# Altium schematic sheet [02]-STLinkV2_1.SchDoc (part 3 of 3)
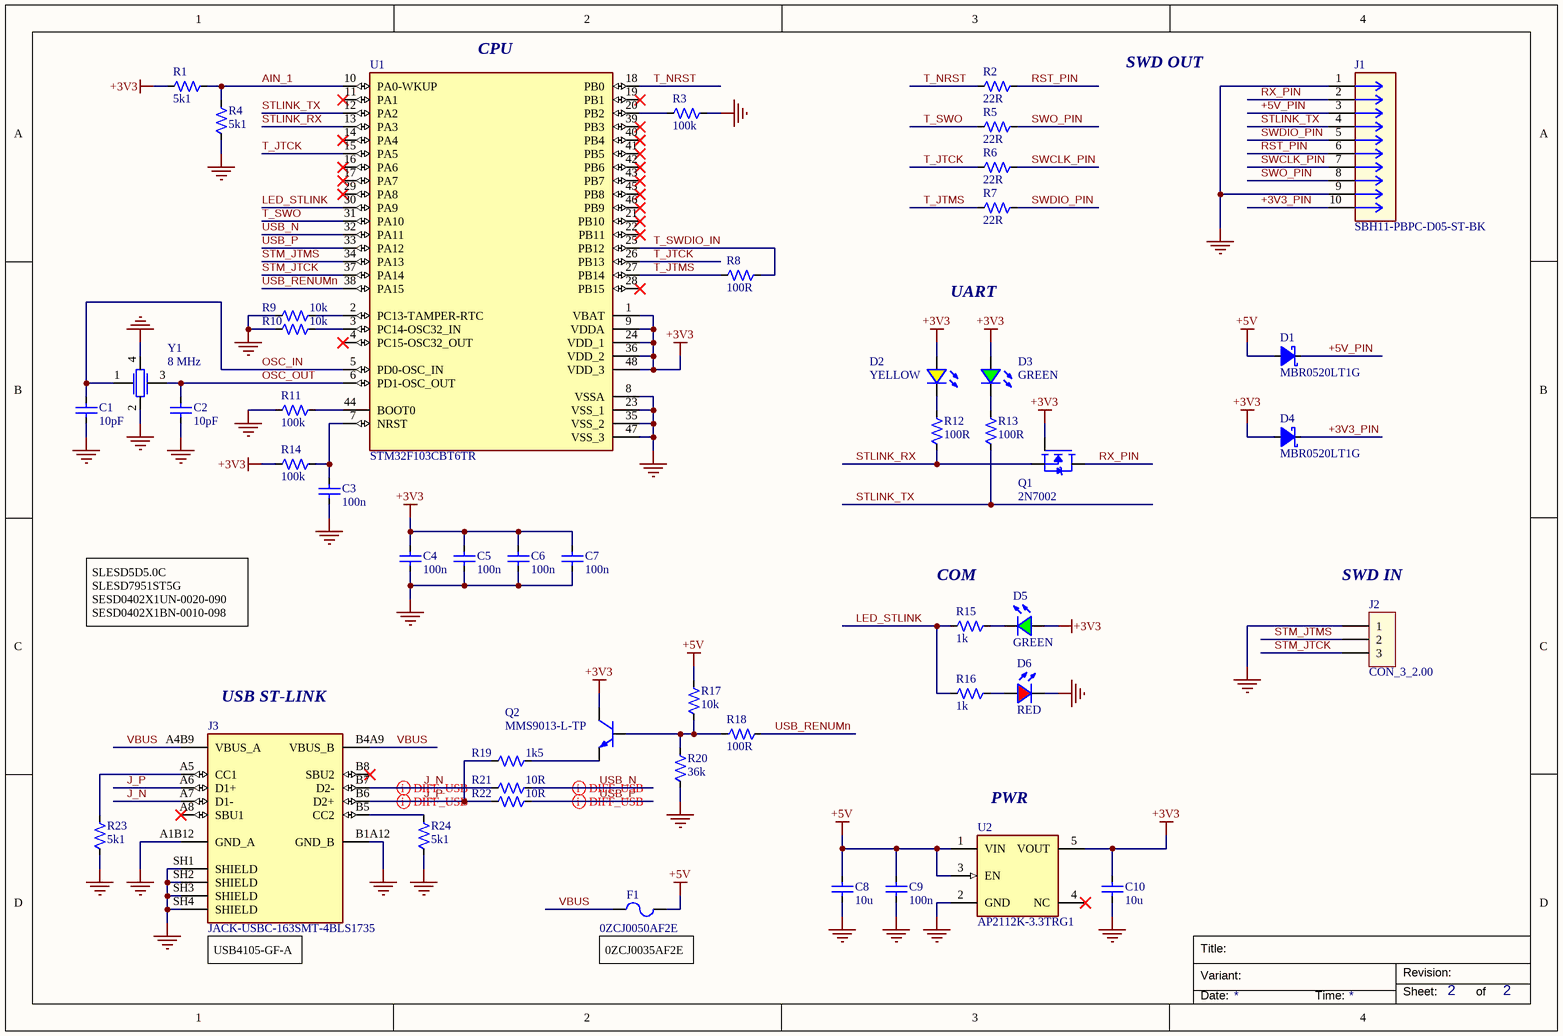
[diagram p2: [02]-STLinkV2_1.SchDoc]

## Library data of the parts (continued)
R19 = RES_AC0402FR-7W1K5L: Fixed Resistor, Metal Glaze/thick Film, 0.125W, 1500ohm, 75V, 1% +/-Tol, 100ppm/Cel, Surface Mount, 0402; Manufacturer 1: Yageo Group; Power Dissipation: 125mW; Resistance: 1.5kΩ; Temperature Coefficient: 100ppm/°C; Voltage Rating: 50V; Supplier 1: DigiKey; Manufacturer Part Number 1: AC0402FR-7W1K5L; Stock 1: 7370; Pricing 1: 1=0,1, 10=0,006, 25=0,0056, 50=0,0052, 100=0,005 (USD); RoHS: Compliant; Case/Package: 0402; China RoHS: Non-Compliant; Composition: Thick Film; Country of Origin: Mainland China, Taiwan; Export Control Classification Number (ECCN) Code: EAR99; Height: 320µm; Harmonized Tariff Schedule (HTS) Code: 8533.21.00.30; Introduction Date: 2017-06-20; Lifecycle Status: Production; Max Operating Temperature: 155°C; Min Operating Temperature: -55°C; Mount: Surface Mount; Number of Terminals: 2; Packaging: Tape & Reel; Power Rating: 125mW; REACH SVHC: Yes; Tolerance: 1%; Width: 500µm; Working Voltage: 75V; ComponentLink1URL: https://datasheet.octopart.com:443/AC0402FR-7W1K5L-Yageo-datasheet-182189377.pdf?src-supplier=IHS; ComponentLink1Description: https://datasheet.octopart.com:443/AC0402FR-7W1K5L-Yageo-datasheet-182189377.pdf?src-supplier=IHS; ComponentLink2URL: https://datasheet.octopart.com:443/AC0402FR-7W1K5L-Yageo-datasheet-83209224.pdf?src-supplier=Upverter; ComponentLink2Description: https://datasheet.octopart.com:443/AC0402FR-7W1K5L-Yageo-datasheet-83209224.pdf?src-supplier=Upverter; ComponentLink3URL: https://datasheet.octopart.com:443/AC0402FR-7W1K5L-Yageo-datasheet-178509465.pdf?src-supplier=Farnell; ComponentLink3Description: https://datasheet.octopart.com:443/AC0402FR-7W1K5L-Yageo-datasheet-178509465.pdf?src-supplier=Farnell; ComponentLink4URL: https://datasheet.octopart.com:443/AC0402FR-7W1K5L-Yageo-datasheet-166720450.pdf?src-supplier=Future+Electronics; ComponentLink4Description: https://datasheet.octopart.com:443/AC0402FR-7W1K5L-Yageo-datasheet-166720450.pdf?src-supplier=Future+Electronics; ComponentLink5URL: https://datasheet.octopart.com:443/AC0402FR-7W1K5L-Yageo-datasheet-151884373.pdf?src-supplier=Future+Electronics; ComponentLink5Description: https://datasheet.octopart.com:443/AC0402FR-7W1K5L-Yageo-datasheet-151884373.pdf?src-supplier=Future+Electronics; ComponentLink6URL: https://datasheet.octopart.com/AC0402FR-7W1K5L-Yageo-datasheet-12512238.pdf; ComponentLink6Description: https://datasheet.octopart.com/AC0402FR-7W1K5L-Yageo-datasheet-12512238.pdf; ComponentLink7URL: http://sigma.octopart.com:80/conflict_mineral_statement/Yageo-company-3.pdf?src-supplier=Compliance+Statements; ComponentLink7Description: http://sigma.octopart.com:80/conflict_mineral_statement/Yageo-company-3.pdf?src-supplier=Compliance+Statements; ComponentLink8URL: http://sigma.octopart.com:80/rohs_statement/Yageo-company-2.pdf?src-supplier=Compliance+Statements; ComponentLink8Description: http://sigma.octopart.com:80/rohs_statement/Yageo-company-2.pdf?src-supplier=Compliance+Statements; Supplier Part Number 1: 13-AC0402FR-7W1K5LCT-ND
R20 = RES_AC0402FR-7W36KL: Chip Resistor Automotive Grade Thick Film 0402 36kOhm 1% Paper T/R; Manufacturer 1: Yageo Group; Power Dissipation: 125mW; Resistance: 36kΩ; Temperature Coefficient: 100ppm/°C; Voltage Rating: 50V; Working Voltage: 75V; Supplier 1: DigiKey; Manufacturer Part Number 1: AC0402FR-7W36KL; Stock 1: 7740; Pricing 1: 1=0,1, 10=0,008, 25=0,0068, 50=0,0052, 100=0,005 (USD); RoHS: Compliant; Case/Package: 0402; China RoHS: Non-Compliant; Composition: Thick Film; Height: 320µm; Lifecycle Status: Production; Max Operating Temperature: 155°C; Min Operating Temperature: -55°C; Mount: Surface Mount; Number of Terminals: 2; Packaging: Tape & Reel; Power Rating: 125mW; REACH SVHC: Yes; Tolerance: 1%; Width: 500µm; ComponentLink1URL: https://datasheet.octopart.com:443/AC0402FR-7W36KL-Yageo-datasheet-182189377.pdf?src-supplier=IHS; ComponentLink1Description: https://datasheet.octopart.com:443/AC0402FR-7W36KL-Yageo-datasheet-182189377.pdf?src-supplier=IHS; ComponentLink2URL: https://datasheet.octopart.com:443/AC0402FR-7W36KL-Yageo-datasheet-83209224.pdf?src-supplier=Upverter; ComponentLink2Description: https://datasheet.octopart.com:443/AC0402FR-7W36KL-Yageo-datasheet-83209224.pdf?src-supplier=Upverter; ComponentLink3URL: https://datasheet.octopart.com:443/AC0402FR-7W36KL-Yageo-datasheet-178509465.pdf?src-supplier=Farnell; ComponentLink3Description: https://datasheet.octopart.com:443/AC0402FR-7W36KL-Yageo-datasheet-178509465.pdf?src-supplier=Farnell; ComponentLink4URL: https://datasheet.octopart.com:443/AC0402FR-7W36KL-Yageo-datasheet-166720450.pdf?src-supplier=Future+Electronics; ComponentLink4Description: https://datasheet.octopart.com:443/AC0402FR-7W36KL-Yageo-datasheet-166720450.pdf?src-supplier=Future+Electronics; ComponentLink5URL: https://datasheet.octopart.com:443/AC0402FR-7W36KL-Yageo-datasheet-151884373.pdf?src-supplier=Future+Electronics; ComponentLink5Description: https://datasheet.octopart.com:443/AC0402FR-7W36KL-Yageo-datasheet-151884373.pdf?src-supplier=Future+Electronics; ComponentLink6URL: https://datasheet.octopart.com/AC0402FR-7W36KL-Yageo-datasheet-12512238.pdf; ComponentLink6Description: https://datasheet.octopart.com/AC0402FR-7W36KL-Yageo-datasheet-12512238.pdf; ComponentLink7URL: http://sigma.octopart.com:80/conflict_mineral_statement/Yageo-company-3.pdf?src-supplier=Compliance+Statements; ComponentLink7Description: http://sigma.octopart.com:80/conflict_mineral_statement/Yageo-company-3.pdf?src-supplier=Compliance+Statements; ComponentLink8URL: http://sigma.octopart.com:80/rohs_statement/Yageo-company-2.pdf?src-supplier=Compliance+Statements; ComponentLink8Description: http://sigma.octopart.com:80/rohs_statement/Yageo-company-2.pdf?src-supplier=Compliance+Statements; Supplier Part Number 1: 13-AC0402FR-7W36KLCT-ND
R21 R22 = RES_AC0402FR-7W10RL: Res Thick Film 0402 10 Ohm 1% 0.125W(1/8W) ±100ppm/C Pad SMD T/R Automotive AEC-Q200; Manufacturer 1: Yageo Group; Power Dissipation: 125mW; Resistance: 10Ω; Temperature Coefficient: 100ppm/°C; Voltage Rating: 50V; Working Voltage: 75V; Supplier 1: DigiKey; Manufacturer Part Number 1: AC0402FR-7W10RL; Stock 1: 159700; Pricing 1: 1=0,1, 10=0,009, 25=0,008, 50=0,0072, 100=0,0068 (USD); RoHS: Compliant; Case/Package: 0402; China RoHS: Non-Compliant; Composition: Thick Film; Country of Origin: Mainland China, Taiwan; Export Control Classification Number (ECCN) Code: EAR99; Height: 320µm; Harmonized Tariff Schedule (HTS) Code: 8533.21.00.30; Introduction Date: 2017-06-20; Lifecycle Status: Production; Max Operating Temperature: 155°C; Min Operating Temperature: -55°C; Mount: Surface Mount; Number of Terminals: 2; Packaging: Tape & Reel; Power Rating: 125mW; REACH SVHC: Yes; Tolerance: 1%; Width: 500µm; ComponentLink1URL: https://datasheet.octopart.com:443/AC0402FR-7W10RL-Yageo-datasheet-182189377.pdf?src-supplier=IHS; ComponentLink1Description: https://datasheet.octopart.com:443/AC0402FR-7W10RL-Yageo-datasheet-182189377.pdf?src-supplier=IHS; ComponentLink2URL: https://datasheet.octopart.com:443/AC0402FR-7W10RL-Yageo-datasheet-83209224.pdf?src-supplier=Upverter; ComponentLink2Description: https://datasheet.octopart.com:443/AC0402FR-7W10RL-Yageo-datasheet-83209224.pdf?src-supplier=Upverter; ComponentLink3URL: https://datasheet.octopart.com:443/AC0402FR-7W10RL-Yageo-datasheet-178509465.pdf?src-supplier=Farnell; ComponentLink3Description: https://datasheet.octopart.com:443/AC0402FR-7W10RL-Yageo-datasheet-178509465.pdf?src-supplier=Farnell; ComponentLink4URL: https://datasheet.octopart.com:443/AC0402FR-7W10RL-Yageo-Group-datasheet-164768995.pdf?src-supplier=ODG+(Origin+Data+Global); ComponentLink4Description: https://datasheet.octopart.com:443/AC0402FR-7W10RL-Yageo-Group-datasheet-164768995.pdf?src-supplier=ODG+(Origin+Data+Global); ComponentLink5URL: https://datasheet.octopart.com/AC0402FR-7W10RL-Yageo-datasheet-12512238.pdf; ComponentLink5Description: https://datasheet.octopart.com/AC0402FR-7W10RL-Yageo-datasheet-12512238.pdf; ComponentLink6URL: http://sigma.octopart.com:80/conflict_mineral_statement/Yageo-company-3.pdf?src-supplier=Compliance+Statements; ComponentLink6Description: http://sigma.octopart.com:80/conflict_mineral_statement/Yageo-company-3.pdf?src-supplier=Compliance+Statements; ComponentLink7URL: http://sigma.octopart.com:80/rohs_statement/Yageo-company-2.pdf?src-supplier=Compliance+Statements; ComponentLink7Description: http://sigma.octopart.com:80/rohs_statement/Yageo-company-2.pdf?src-supplier=Compliance+Statements; Supplier Part Number 1: 13-AC0402FR-7W10RLCT-ND
U1 = STM32F103CBT6TR: MCU 32-bit STM32F1 ARM Cortex M3 RISC 128KB Flash 2.5V/3.3V 48-Pin LQFP T/R; Manufacturer 1: STMicroelectronics; ADC Channels (Resolution): 10-Ch 12-Bit; Data Bus Width: 32b; EEPROM Memory Size: 0B; Frequency: 72MHz; Interface: CAN, IrDA, LIN, USB; Max Frequency: 1.25MHz; Max Junction Temperature (Tj): 105°C; Max Power Dissipation: 363mW; Max Supply Current: 50mA; Max Supply Voltage: 3.6V; Min Supply Voltage: 2V; Nominal Supply Current: 1.7µA; Number of A/D Converters: 2; Number of ADC Channels: 10; Number of I/Os: 37; Number of PWM Channels: 4; Number of UART Channels: 3; Number of USB Channels: 1; Operating Supply Voltage: 3.3V; Oscillator Type: Internal; Peripherals: POR; RAM Size: 20kB; Watchdog Timer: Yes; Supplier 1: DigiKey; Manufacturer Part Number 1: STM32F103CBT6TR; Stock 1: 18093; Pricing 1: 1=6,9, 10=5,316, 25=4,92, 100=4,4847, 250=4,2772, 500=4,1521, 1000=4,04916 (USD); RoHS: Compliant; Ambient Temperature Range High: 105°C; Case/Package: LQFP; China RoHS: Compliant; Core Architecture: ARM; Flash Memory Size: 128kB; Height: 1.6mm; Height - Seated (Max): 1.6mm; Lead Free: Lead Free; Length: 7mm; Lifecycle Status: Production; Max Operating Temperature: 85°C; Memory Size: 128kB; Memory Type: FLASH; Min Operating Temperature: -40°C; Number of Channels: 10; Number of I2C Channels: 2; Number of Pins: 48; Number of Programmable I/O: 37; Number of SPI Channels: 2; Number of Terminals: 48; Number of Timers/Counters: 4; Number of USART Channels: 3; Packaging: Tape and Reel; Radiation Hardening: No; REACH SVHC: Yes; Schedule B: 8542310000, 8542310000|8542310000|8542310000|8542310000|8542310000; Terminal Pitch: 500µm; Width: 7mm; ComponentLink1URL: https://datasheet.octopart.com:443/STM32F103CBT6TR-STMicroelectronics-datasheet-177520228.pdf?src-supplier=IHS; ComponentLink1Description: https://datasheet.octopart.com:443/STM32F103CBT6TR-STMicroelectronics-datasheet-177520228.pdf?src-supplier=IHS; ComponentLink2URL: https://datasheet.octopart.com:443/STM32F103CBT6TR-STMicroelectronics-datasheet-14363502.pdf?src-supplier=Upverter; ComponentLink2Description: https://datasheet.octopart.com:443/STM32F103CBT6TR-STMicroelectronics-datasheet-14363502.pdf?src-supplier=Upverter; ComponentLink3URL: https://datasheet.octopart.com:443/STM32F103CBT6TR-STMicroelectronics-datasheet-48026265.pdf?src-supplier=SHENGYU+ELECTRONICS; ComponentLink3Description: https://datasheet.octopart.com:443/STM32F103CBT6TR-STMicroelectronics-datasheet-48026265.pdf?src-supplier=SHENGYU+ELECTRONICS; ComponentLink4URL: https://datasheet.octopart.com:443/STM32F103CBT6TR-STMicroelectronics-datasheet-10330614.pdf?src-supplier=Future+Electronics; ComponentLink4Description: https://datasheet.octopart.com:443/STM32F103CBT6TR-STMicroelectronics-datasheet-10330614.pdf?src-supplier=Future+Electronics; ComponentLink5URL: https://datasheet.octopart.com:443/STM32F103CBT6TR-STMicroelectronics-datasheet-134581200.pdf?src-supplier=Future+Electronics; ComponentLink5Description: https://datasheet.octopart.com:443/STM32F103CBT6TR-STMicroelectronics-datasheet-134581200.pdf?src-supplier=Future+Electronics; ComponentLink6URL: https://datasheet.octopart.com:443/STM32F103CBT6TR-STMicroelectronics-datasheet-500013.pdf?src-supplier=STMicroelectronics; ComponentLink6Description: https://datasheet.octopart.com:443/STM32F103CBT6TR-STMicroelectronics-datasheet-500013.pdf?src-supplier=STMicroelectronics; ComponentLink7URL: https://datasheet.octopart.com:443/STM32F103CBT6TR-STMicroelectronics-datasheet-14106722.pdf?src-supplier=iiiC; ComponentLink7Description: https://datasheet.octopart.com:443/STM32F103CBT6TR-STMicroelectronics-datasheet-14106722.pdf?src-supplier=iiiC; ComponentLink8URL: https://datasheet.octopart.com:443/STM32F103CBT6TR-STMicroelectronics-datasheet-17594274.pdf?src-supplier=TME; ComponentLink8Description: https://datasheet.octopart.com:443/STM32F103CBT6TR-STMicroelectronics-datasheet-17594274.pdf?src-supplier=TME; Supplier Part Number 1: 497-17380-1-ND
U2 = AP2112K-3.3TRG1: AP2112 Series 0.6 A 3.3 V Fixed Output SMT LDO Linear Regulator - SOT23-5; Manufacturer 1: Diodes Inc.; Accuracy: 1.5%; Dropout Voltage: 250mV; Max Input Voltage: 6V; Max Junction Temperature (Tj): 85°C; Max Output Current: 600mA; Min Input Voltage: 2.5V; Nominal Supply Current: 55µA; Number of Channels: 1; Output Voltage: 3.3V; Polarity: Positive; Supplier 1: DigiKey; Manufacturer Part Number 1: AP2112K-3.3TRG1; Stock 1: 32841; Pricing 1: 1=0,22, 10=0,153, 25=0,1348, 100=0,1151, 250=0,10576, 500=0,1001, 1000=0,09545 (USD); RoHS: Compliant; Ambient Temperature Range High: 85°C; Case/Package: SOT-23-5; China RoHS: Compliant; Height: 1.4mm; Height - Seated (Max): 1.45mm; Lead Free: Lead Free; Length: 2.92mm; Lifecycle Status: Production; Max Operating Temperature: 85°C; Max Supply Voltage: 6V; Min Operating Temperature: -40°C; Min Supply Voltage: 2.5V; Mount: Surface Mount; Number of Circuits: 1; Number of Outputs: 1; Number of Pins: 5; Number of Regulators: 1; Number of Terminals: 5; Output Current: 600mA; Output Type: Fixed; Packaging: Digi-Reel®; Quiescent Current: 55µA; REACH SVHC: Yes; Schedule B: 8542390000, 8542390000|8542390000|8542390000|8542390000|8542390000; Terminal Pitch: 950µm; Voltage Tolerance: 1.5%; Width: 1.6mm; ComponentLink1URL: https://datasheet.octopart.com:443/AP2112K-3.3TRG1-Diodes-Inc.-datasheet-101745658.pdf?src-supplier=IHS; ComponentLink1Description: https://datasheet.octopart.com:443/AP2112K-3.3TRG1-Diodes-Inc.-datasheet-101745658.pdf?src-supplier=IHS; ComponentLink2URL: https://datasheet.octopart.com:443/AP2112K-3.3TRG1-Diodes-Inc.-datasheet-182385097.pdf?src-supplier=IHS; ComponentLink2Description: https://datasheet.octopart.com:443/AP2112K-3.3TRG1-Diodes-Inc.-datasheet-182385097.pdf?src-supplier=IHS; ComponentLink3URL: https://datasheet.octopart.com:443/AP2112K-3.3TRG1-Diodes-Inc.-datasheet-37177583.pdf?src-supplier=SHENGYU+ELECTRONICS; ComponentLink3Description: https://datasheet.octopart.com:443/AP2112K-3.3TRG1-Diodes-Inc.-datasheet-37177583.pdf?src-supplier=SHENGYU+ELECTRONICS; ComponentLink4URL: https://sigma.octopart.com:443/138895853/technical_drawing/Diodes-Inc.-AP2112K-3.3TRG1.pdf?src-supplier=Upverter; ComponentLink4Description: https://sigma.octopart.com:443/138895853/technical_drawing/Diodes-Inc.-AP2112K-3.3TRG1.pdf?src-supplier=Upverter; Supplier Part Number 1: AP2112K-3.3TRG1DICT-ND
Y1 = Y_ECS-80-10-33-CKM-TR3: CRYSTAL 8.0000MHZ 10PF SMD; Manufacturer 1: ECS International; PART DESCRIPTION: 8 MHz ±10ppm Crystal 10pF 400 Ohms 4-SMD, No Lead; MFG: ECS Inc.; Supplier 1: Digikey; Manufacturer Part Number 1: ECS-80-10-33-CKM-TR3; Stock 1: 2920; Pricing 1: 1=0,61, 10=0,532, 50=0,4824, 100=0,4625, 500=0,41928, 1000=0,40194 (USD); RoHS: No; ComponentLink1URL: https://datasheet.octopart.com/ECS-80-10-33-CKM-TR3-ECS-International-datasheet-140089731.pdf?src-supplier=Master+Electronics; ComponentLink1Description: https://datasheet.octopart.com/ECS-80-10-33-CKM-TR3-ECS-International-datasheet-140089731.pdf?src-supplier=Master+Electronics; Supplier Part Number 1: 50-ECS-80-10-33-CKM-TR3CT-ND; MFG PART NUMBER: ECS-80-10-33-CKM-TR3; PACKAGE: 4-SMD (3.2x2.5); PART SUPPLIER LINK 1: https://www.digikey.com/en/products/detail/ecs-inc/ECS-80-10-33-CKM-TR3/15997137; PART TYPE: Crystals